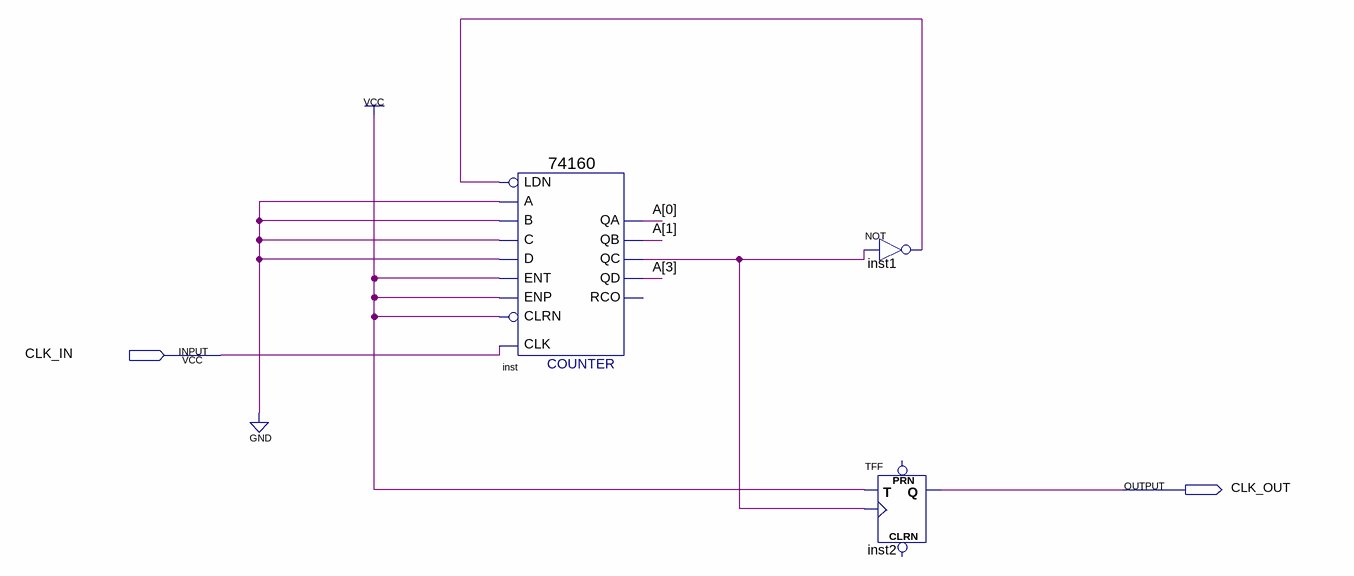
[diagram p0: schematic sheet]
// Quartus schematic 10DIV.bdf as structural Verilog: 3 symbols, 2 pins
module \10DIV  (
  input  CLK_IN,
  output CLK_OUT
);

  wire inst1_out, inst_qc;
  wire [3:0] A;

  \74160  inst (
    .CLK(CLK_IN), .ENT(1'b1), .A(1'b0), .B(1'b0), .C(1'b0), .D(1'b0), .LDN(inst1_out), .ENP(1'b1),
    .CLRN(1'b1), .QD(A[3]), .QA(A[0]), .QB(A[1]), .QC(inst_qc));  // open: RCO
  not inst1 (inst1_out, inst_qc);
  TFF inst2 (.T(1'b1), .CLK(inst_qc), .Q(CLK_OUT));  // open: PRN, CLRN
endmodule
